# Altium schematic sheet 19.EMMC_FLASH.SchDoc
size A4; SheetNumber: 19; SheetTotal: 21
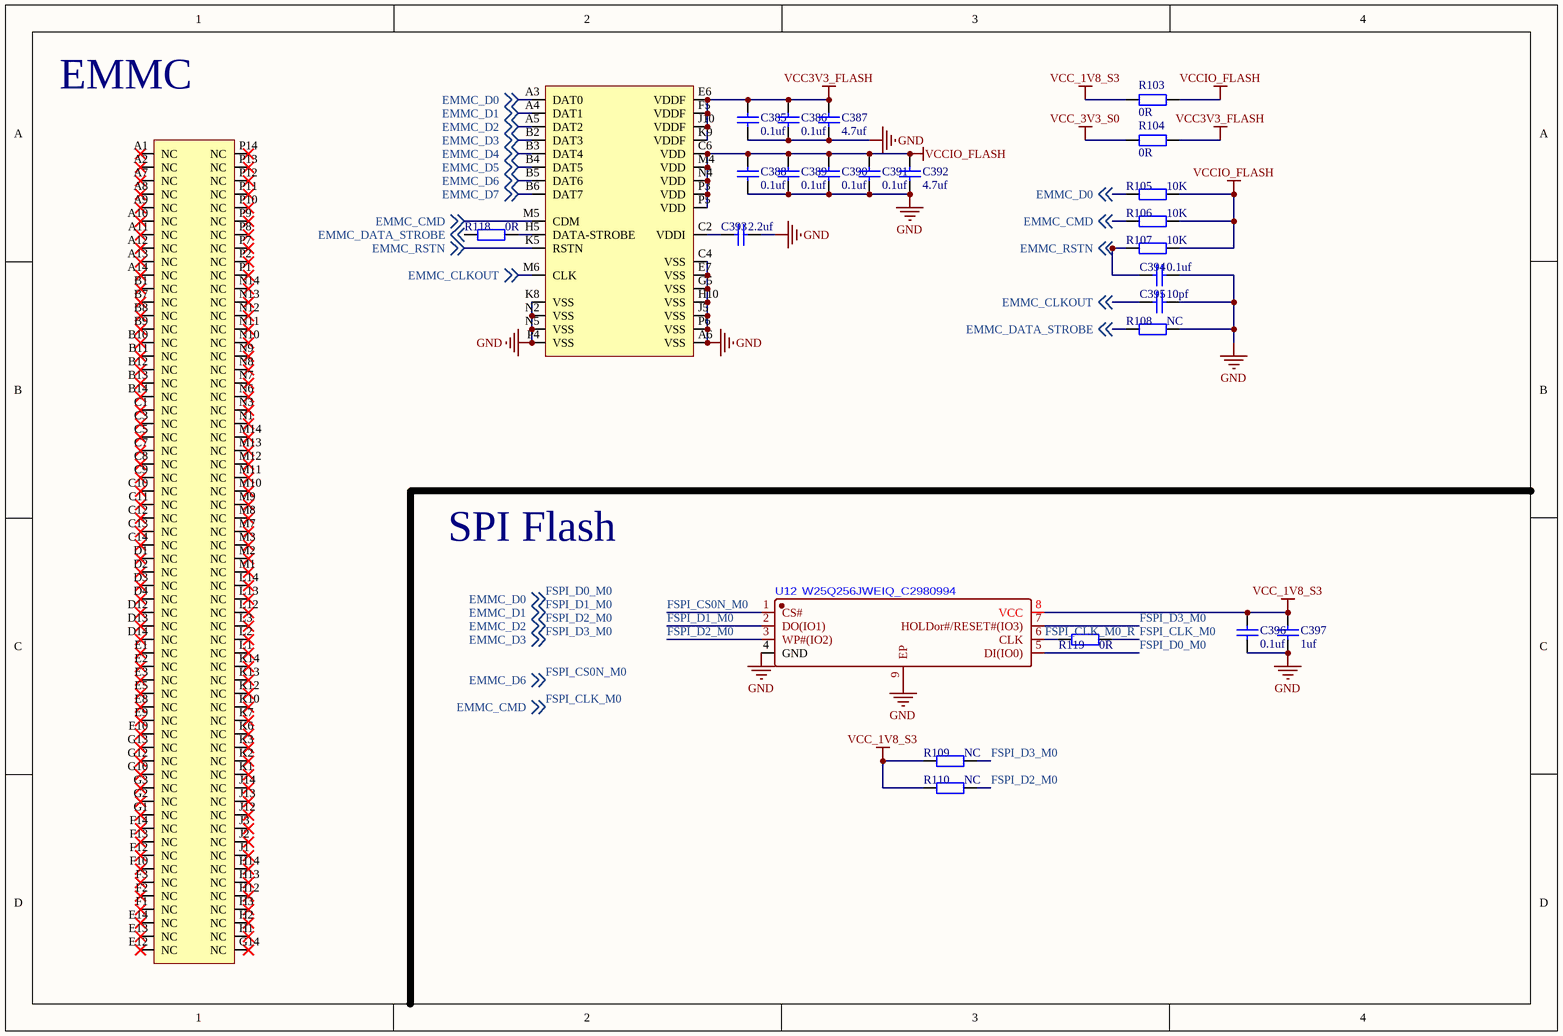
[diagram p0: 19.EMMC_FLASH.SchDoc]

## Parts
C385  0.1uf  [C0402_L]
C386  0.1uf  [C0402_L]
C387  4.7uf  [C0402_L]
C388  0.1uf  [C0402_L]
C389  0.1uf  [C0402_L]
C390  0.1uf  [C0402_L]
C391  0.1uf  [C0402_L]
C392  4.7uf  [C0402_L]
C393  2.2uf  [C0402_L]
C394  0.1uf  [C0402_L]
C395  10pf  [C0402_L]
C396  0.1uf  [C0201_L]
C397  1uf  [C0402_L]
R103  0R  [R0603_L]
R104  0R  [R0603_L]
R105  10K  [R0402_L]
R106  10K  [R0402_L]
R107  10K  [R0402_L]
R108  NC  [R0402_L]
R109  NC  [R0201_L]
R110  NC  [R0201_L]
R118  0R  [R0201_L]
R119  0R  [R0201_L]
U11  KLMBG2JETD-B041  [FBGA-153]  (value not drawn)  (parts A,B of 2)
U12  W25Q256JWEIQ_C2980994  [WSON-8_L8.0-W6.0-P1.27-TL-EP-1]

## Nets
GND: C385.2 C386.2 C387.2 C388.2 C389.2 C390.2 C391.2 C392.2 C393.1 C394.1 C395.1 C396.1 C397.1 R108.1 U11.A6(VSS) U11.C4(VSS) U11.E7(VSS) U11.G5(VSS) U11.H10(VSS) U11.J5(VSS) U11.K8(VSS) U11.N2(VSS) U11.N5(VSS) U11.P4(VSS) U11.P6(VSS) U12.4(GND) U12.9(EP)
VCC3V3_FLASH: C385.1 C386.1 C387.1 R104.2 U11.E6(VDDF) U11.F5(VDDF) U11.J10(VDDF) U11.K9(VDDF)
VCC_1V8_S3: C396.2 C397.2 R103.1 R109.1 R110.1 U12.8(VCC)
VCC_3V3_S0: R104.1
VCCIO_FLASH: C388.1 C389.1 C390.1 C391.1 C392.1 R103.2 R105.1 R106.1 R107.1 U11.C6(VDD) U11.M4(VDD) U11.N4(VDD) U11.P3(VDD) U11.P5(VDD)
EMMC_CLKOUT: C395.2 U11.M6(CLK) ; off-sheet EMMC_CLKOUT
EMMC_D4: U11.B3(DAT4) ; off-sheet EMMC_D4
EMMC_D5: U11.B4(DAT5) ; off-sheet EMMC_D5
EMMC_D7: U11.B6(DAT7) ; off-sheet EMMC_D7
EMMC_DATA_STROBE: R108.2 R118.1 ; off-sheet EMMC_DATA_STROBE
EMMC_RSTN: C394.2 R107.2 U11.K5(RSTN) ; off-sheet EMMC_RSTN
FSPI_CLK_M0: R106.2 R119.2 U11.M5(CDM) ; off-sheet EMMC_CMD  [also labelled EMMC_CMD]
FSPI_CLK_M0_R: R119.1 U12.6(CLK)
FSPI_CS0N_M0: U11.B5(DAT6) U12.1(CS#) ; off-sheet EMMC_D6  [also labelled EMMC_D6]
FSPI_D0_M0: R105.2 U11.A3(DAT0) U12.5(DI(IO0)) ; off-sheet EMMC_D0  [also labelled EMMC_D0]
FSPI_D1_M0: U11.A4(DAT1) U12.2(DO(IO1)) ; off-sheet EMMC_D1  [also labelled EMMC_D1]
FSPI_D2_M0: R110.2 U11.A5(DAT2) U12.3(WP#(IO2)) ; off-sheet EMMC_D2  [also labelled EMMC_D2]
FSPI_D3_M0: R109.2 U11.B2(DAT3) U12.7(HOLDor#/RESET#(IO3)) ; off-sheet EMMC_D3  [also labelled EMMC_D3]
NetC393_2: C393.2 U11.C2(VDDI)
NetR118_2: R118.2 U11.H5(DATA-STROBE)

Not connected (* = marked no-connect by the designer): U11 A1(NC)* A2(NC)* A7(NC)* A8(NC)* A9(NC)* A10(NC)* A11(NC)* A12(NC)* A13(NC)* A14(NC)* B1(NC)* B7(NC)* B8(NC)* B9(NC)* B10(NC)* B11(NC)* B12(NC)* B13(NC)* B14(NC)* C1(NC)* C3(NC)* C5(NC)* C7(NC)* C8(NC)* C9(NC)* C10(NC)* C11(NC)* C12(NC)* C13(NC)* C14(NC)* D1(NC)* D2(NC)* D3(NC)* D4(NC)* D12(NC)* D13(NC)* D14(NC)* E1(NC)* E2(NC)* E3(NC)* E5(NC)* E8(NC)* E9(NC)* E10(NC)* E12(NC)* E13(NC)* E14(NC)* F1(NC)* F2(NC)* F3(NC)* F10(NC)* F12(NC)* F13(NC)* F14(NC)* G1(NC)* G2(NC)* G3(NC)* G10(NC)* G12(NC)* G13(NC)* G14(NC)* H1(NC)* H2(NC)* H3(NC)* H12(NC)* H13(NC)* H14(NC)* J1(NC)* J2(NC)* J3(NC)* J12(NC)* J13(NC)* J14(NC)* K1(NC)* K2(NC)* K3(NC)* K6(NC)* K7(NC)* K10(NC)* K12(NC)* K13(NC)* K14(NC)* L1(NC)* L2(NC)* L3(NC)* L12(NC)* L13(NC)* L14(NC)* M1(NC)* M2(NC)* M3(NC)* M7(NC)* M8(NC)* M9(NC)* M10(NC)* M11(NC)* M12(NC)* M13(NC)* M14(NC)* N1(NC)* N3(NC)* N6(NC)* N7(NC)* N8(NC)* N9(NC)* N10(NC)* N11(NC)* N12(NC)* N13(NC)* N14(NC)* P1(NC)* P2(NC)* P7(NC)* P8(NC)* P9(NC)* P10(NC)* P11(NC)* P12(NC)* P13(NC)* P14(NC)*

## Notes on the sheet
- EMMC
- SPI Flash

## Library data of the parts
C385-C397 = C: 贴片电容/MLCC电容
R103-R110 R118 R119 = R: 贴片电阻
U11 = KLMBG2JETD-B041: 32GB EMMC5.1